# EAGLE schematic contra1567 (EAGLE 7.5.0)
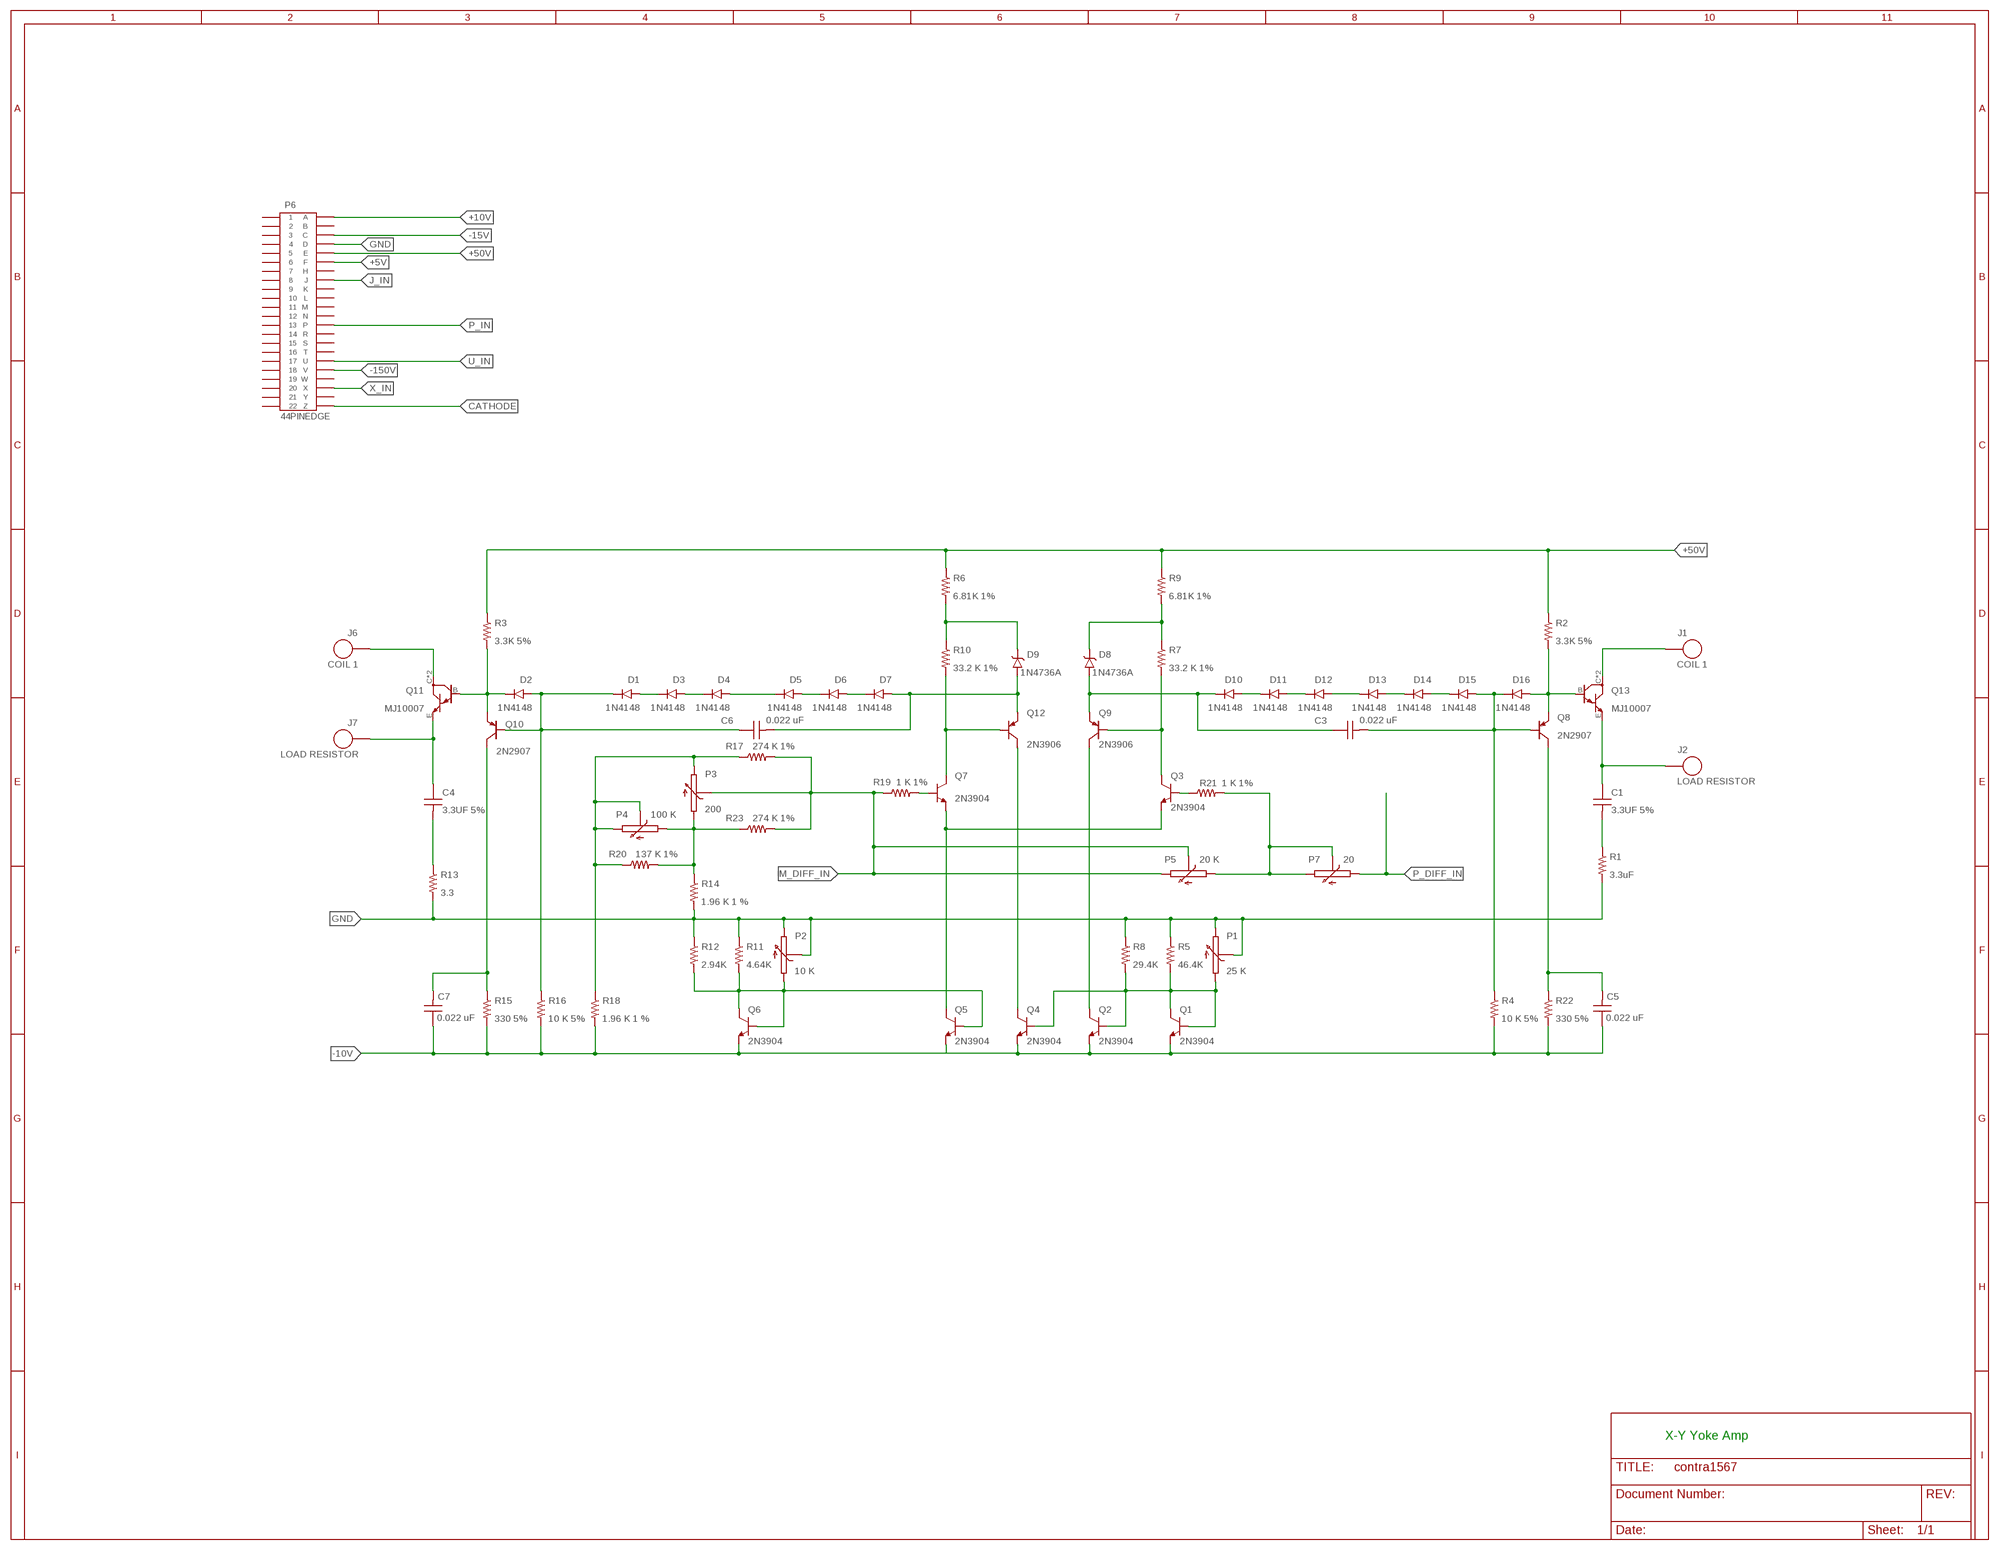
[diagram p0: schematic, sheet 1]

## Parts
C1  3.3UF 5%  ECQ-E2335JF  [CAP-3-PT-ZERO-3UF-250V-FILM]
C3  0.022 uF  ECQ-E2223JF  [CAP-ZERO-PT-ZERO-22UF-250V-FILM]
C4  3.3UF 5%  ECQ-E2335JF  [CAP-3-PT-ZERO-3UF-250V-FILM]
C5  0.022 uF  ECQ-E2223JF  [CAP-ZERO-PT-ZERO-22UF-250V-FILM]
C6  0.022 uF  ECQ-E2223JF  [CAP-ZERO-PT-ZERO-22UF-250V-FILM]
C7  0.022 uF  ECQ-E2223JF  [CAP-ZERO-PT-ZERO-22UF-250V-FILM]
D1  1N4148  [DO35-7]
D2  1N4148  [DO35-7]
D3  1N4148  [DO35-7]
D4  1N4148  [DO35-7]
D5  1N4148  [DO35-7]
D6  1N4148  [DO35-7]
D7  1N4148  [DO35-7]
D8  1N4736A  [DO41]
D9  1N4736A  [DO41]
D10  1N4148  [DO35-7]
D11  1N4148  [DO35-7]
D12  1N4148  [DO35-7]
D13  1N4148  [DO35-7]
D14  1N4148  [DO35-7]
D15  1N4148  [DO35-7]
D16  1N4148  [DO35-7]
J1  COIL 1  AWG18  [AWG18]
J2  LOAD RESISTOR  AWG18  [AWG18]
J6  COIL 1  AWG18  [AWG18]
J7  LOAD RESISTOR  AWG18  [AWG18]
P1  25 K  POT-3006P  [3006P]
P2  10 K  POT-3006P  [3006P]
P3  200  POT-3006P  [3006P]
P4  100 K  POT-3006P  [3006P]
P5  20 K  POT-3006P  [3006P]
P6  44PINEDGE  [44PINEDGE]
P7  20  POT-3006P  [3006P]
Q1  2N3904  [TO92]
Q2  2N3904  [TO92]
Q3  2N3904  [TO92]
Q4  2N3904  [TO92]
Q5  2N3904  [TO92]
Q6  2N3904  [TO92]
Q7  2N3904  [TO92]
Q8  2N2907  [TO18]
Q9  2N3906  [TO92]
Q10  2N2907  [TO18]
Q11  MJ10007  [TO3]
Q12  2N3906  [TO92]
Q13  MJ10007  [TO3]
R1  3.3uF  AXIALRESISTORTHREE_WATT  [R_THREEWATT]
R2  3.3K 5%  AXIALRESISTORTWO_WATT  [R_TWOWATT]
R3  3.3K 5%  AXIALRESISTORTWO_WATT  [R_TWOWATT]
R4  10 K 5%  AXIALRESISTORHALF_WATT  [R_HALFWATT]
R5  46.4K  AXIALRESISTORQUARTER_WATT  [R_QUARTERWATT]
R6  6.81K 1%  AXIALRESISTORHALF_WATT  [R_HALFWATT]
R7  33.2 K 1%  AXIALRESISTORHALF_WATT  [R_HALFWATT]
R8  29.4K  AXIALRESISTORQUARTER_WATT  [R_QUARTERWATT]
R9  6.81K 1%  AXIALRESISTORHALF_WATT  [R_HALFWATT]
R10  33.2 K 1%  AXIALRESISTORHALF_WATT  [R_HALFWATT]
R11  4.64K  AXIALRESISTORQUARTER_WATT  [R_QUARTERWATT]
R12  2.94K  AXIALRESISTORQUARTER_WATT  [R_QUARTERWATT]
R13  3.3  AXIALRESISTORTHREE_WATT  [R_THREEWATT]
R14  1.96 K 1 %  AXIALRESISTORQUARTER_WATT  [R_QUARTERWATT]
R15  330 5%  AXIALRESISTORONE_WATT  [R_ONEWATT]
R16  10 K 5%  AXIALRESISTORHALF_WATT  [R_HALFWATT]
R17  274 K 1%  AXIALRESISTORQUARTER_WATT  [R_QUARTERWATT]
R18  1.96 K 1 %  AXIALRESISTORQUARTER_WATT  [R_QUARTERWATT]
R19  1 K 1%  AXIALRESISTORQUARTER_WATT  [R_QUARTERWATT]
R20  137 K 1%  AXIALRESISTORQUARTER_WATT  [R_QUARTERWATT]
R21  1 K 1%  AXIALRESISTORQUARTER_WATT  [R_QUARTERWATT]
R22  330 5%  AXIALRESISTORONE_WATT  [R_ONEWATT]
R23  274 K 1%  AXIALRESISTORQUARTER_WATT  [R_QUARTERWATT]

## Nets
+5V: P6.F
+10V: P6.A
+50V: P6.E R2.1 R3.1 R6.1 R9.1
-10V: C5.1 C7.1 Q1.3(E) Q2.3(E) Q4.3(E) Q6.3(E) R4.2 R15.2 R16.2 R18.2 R22.2
-15V: P6.C
-150V: P6.V
CATHODE: P6.Z
GND: P1.2(S) P1.3(E) P2.2(S) P2.3(E) P6.D R1.2 R5.1 R8.1 R11.1 R12.1 R13.2 R14.2
J_IN: P6.J
M_DIFF_IN: P3.2(S) P5.2(S) P5.3(E) R17.2 R19.1 R23.2
N$1: J1.P$1 Q13.C Q13.C/(C)
N$2: C1.1 J2.P$1 Q13.E
N$3: C1.2 R1.1
N$4: P1.1(A) Q1.1(C) Q1.2(B) Q2.2(B) Q4.2(B) R5.2 R8.2
N$5: D16.A Q8.1(E) Q13.B R2.2
N$6: Q3.2(B) R21.1
N$7: C3.2 D15.A D16.C Q8.2(B) R4.1
N$8: C5.2 Q8.3(C) R22.1
N$9: Q4.1(C) Q12.1(C)
N$10: D14.A D15.C
N$11: D13.A D14.C
N$12: D12.A D13.C
N$13: D11.A D12.C
N$14: D10.A D11.C
N$15: C3.1 D8.A D10.C Q9.3(E)
N$16: Q3.1(C) Q9.2(B) R7.2
N$17: D8.C R7.1 R9.2
N$18: P5.1(A) P7.2(S) P7.3(E) R21.2
N$19: Q3.3(E) Q5.1(C) Q7.3(E)
N$20: D9.C R6.2 R10.1
N$21: Q2.1(C) Q9.1(C)
N$22: P3.1(A) P4.1(A) R14.1 R20.2 R23.1
N$23: Q5.3(E)
N$25: Q7.1(C) Q12.2(B) R10.2
N$26: J6.P$1 Q11.C Q11.C/(C)
N$27: C4.1 J7.P$1 Q11.E
N$29: P2.1(A) Q5.2(B) Q6.1(C) Q6.2(B) R11.2 R12.2
N$30: C4.2 R13.1
N$31: D2.C Q10.1(E) Q11.B R3.2
N$33: C6.1 D1.C D2.A Q10.2(B) R16.1
N$34: C7.2 Q10.3(C) R15.1
N$35: D1.A D3.C
N$36: D3.A D4.C
N$37: D4.A D5.C
N$38: D5.A D6.C
N$39: D6.A D7.C
N$40: C6.2 D7.A D9.A Q12.3(E)
N$43: Q7.2(B) R19.2
N$44: P3.3(E) P4.2(S) P4.3(E) R17.1 R18.1 R20.1
P_DIFF_IN: P7.1(A)
P_IN: P6.P
U_IN: P6.U
X_IN: P6.X
Unconnected: P6.1 P6.2 P6.3 P6.4 P6.5 P6.6 P6.7 P6.8 P6.9 P6.10 P6.11 P6.12 P6.13 P6.14 P6.15 P6.16 P6.17 P6.18 P6.19 P6.20 P6.21 P6.22 P6.B P6.H P6.K P6.L P6.M P6.N P6.R P6.S P6.T P6.W P6.Y

## Notes on the sheet
- X-Y Yoke Amp

## Library data of the parts
C1 C4 = keiths:ECQ-E2335JF: FILM CAPACITOR, 3.3UF, 250V, 5%, RADIAL Capacitor Dielectric Type:PET (Polyester) Metallized Polyester Film Capacitor; PN: ECQ-E2335JF
C3 C5-C7 = keiths:ECQ-E2223JF: FILM CAPACITOR, 0.022UF, 250V, 5%, RADIAL Capacitor Dielectric Type:PET (Polyester) Lead Spacing:10mm; PN: ECQ-E2223JFB
D1-D7 D10-D16 = keiths:1N4148: High Conductance Fast Diode; PN: 1N4148
D8 D9 = keiths:1N4736A: Z DIODE 6.8 V, 1W, 5 percent; PN: 1N4736A
J1 J2 J6 J7 = keiths:AWG18: AWG18 Wire Hole
P1 = keiths:POT-3006P: 3006 - Trimpot® Trimming Potentiometer. Clockwise turn moves wiper to pin 3; PN: 3006P-1-253LF
P2 = keiths:POT-3006P: 3006 - Trimpot® Trimming Potentiometer. Clockwise turn moves wiper to pin 3; PN: 3006P-1-103LF
P3 = keiths:POT-3006P: 3006 - Trimpot® Trimming Potentiometer. Clockwise turn moves wiper to pin 3; PN: 3006P-1-201LF
P4 = keiths:POT-3006P: 3006 - Trimpot® Trimming Potentiometer. Clockwise turn moves wiper to pin 3; PN: 3006P-1-104LF
P5 = keiths:POT-3006P: 3006 - Trimpot® Trimming Potentiometer. Clockwise turn moves wiper to pin 3; PN: 3006P-1-203LF
P6 = keiths:44PINEDGE: 44 PIN EDGE CONNECTOR FOR PCB
P7 = keiths:POT-3006P: 3006 - Trimpot® Trimming Potentiometer. Clockwise turn moves wiper to pin 3; PN: 3006P-1-200LF
Q1-Q7 = keiths:2N3904: NPN Transistor; PN: 2N3904
Q8 Q10 = keiths:2N2907: The 2N2907 is a commonly available PNP bipolar junction transistor used for general purpose low-power amplifying or switching applications. It is designed for low to medium current, low power, medium voltage, and can operate at moderately high speeds.; PN: 2N2907A
Q9 Q12 = keiths:2N3906: PNP Transistor; PN: 2N3906
Q11 Q13 = keiths:MJ10007: NPN Darlington; PN: MJ10007
R1 = keiths:AXIALRESISTOR: Through hole axial leaded resistors.; PN: ECQ-E2335JF
R2 R3 = keiths:AXIALRESISTOR: Through hole axial leaded resistors.; PN: RR02J3K3TB
R4 R16 = keiths:AXIALRESISTOR: Through hole axial leaded resistors.; PN: MF1/2LCT52R103J
R5 = keiths:AXIALRESISTOR: Through hole axial leaded resistors.; PN: RNF14FTD46K4
R6 R9 = keiths:AXIALRESISTOR: Through hole axial leaded resistors.; PN: MFS1/2DCT52R6811F
R7 R10 = keiths:AXIALRESISTOR: Through hole axial leaded resistors.; PN: SFR16S0003322FR500
R8 = keiths:AXIALRESISTOR: Through hole axial leaded resistors.; PN: RNF14FTD29K4
R11 = keiths:AXIALRESISTOR: Through hole axial leaded resistors.; PN: RNF14FTD4K64
R12 = keiths:AXIALRESISTOR: Through hole axial leaded resistors.; PN: RNF14FTD2K94
R13 = keiths:AXIALRESISTOR: Through hole axial leaded resistors.; PN: PR03000203308JAC00
R14 R18 = keiths:AXIALRESISTOR: Through hole axial leaded resistors.; PN: RNF14FTD1K96
R15 R22 = keiths:AXIALRESISTOR: Through hole axial leaded resistors.; PN: SFR16S0003300JA500
R17 R23 = keiths:AXIALRESISTOR: Through hole axial leaded resistors.; PN: MFR-25FBF52-274K
R19 R21 = keiths:AXIALRESISTOR: Through hole axial leaded resistors.; PN: MFR-25FRF52-1K
R20 = keiths:AXIALRESISTOR: Through hole axial leaded resistors.; PN: MFR-25FBF52-137K